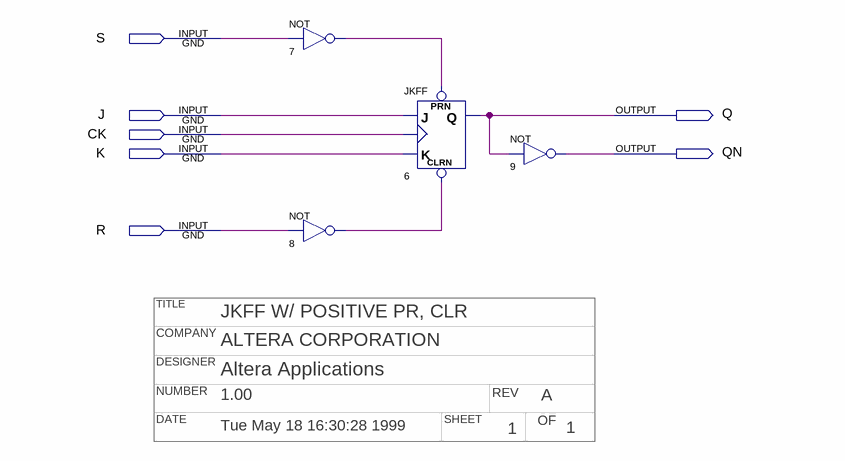
[diagram p0: schematic sheet]
// Quartus schematic jkffre.bdf as structural Verilog: 4 symbols, 7 pins
// Title block: TITLE: JKFF W/ POSITIVE PR, CLR; COMPANY: ALTERA CORPORATION; DESIGNER: Altera Applications; NUMBER: 1.00; REV: A; DATE: Tue May 18 16:30:28 1999; SHEET: 1; OF: 1
module jkffre (
  input  S,
  input  J,
  input  CK,
  input  K,
  input  R,
  output Q,
  output QN
);

  wire n7_out, n8_out;

  not u_7 (n7_out, S);
  not u_8 (n8_out, R);
  JKFF u_6 (.PRN(n7_out), .CLRN(n8_out), .K(K), .J(J), .CLK(CK), .Q(Q));
  not u_9 (QN, Q);
endmodule
